# EAGLE design iqdemod (EAGLE 6.3)
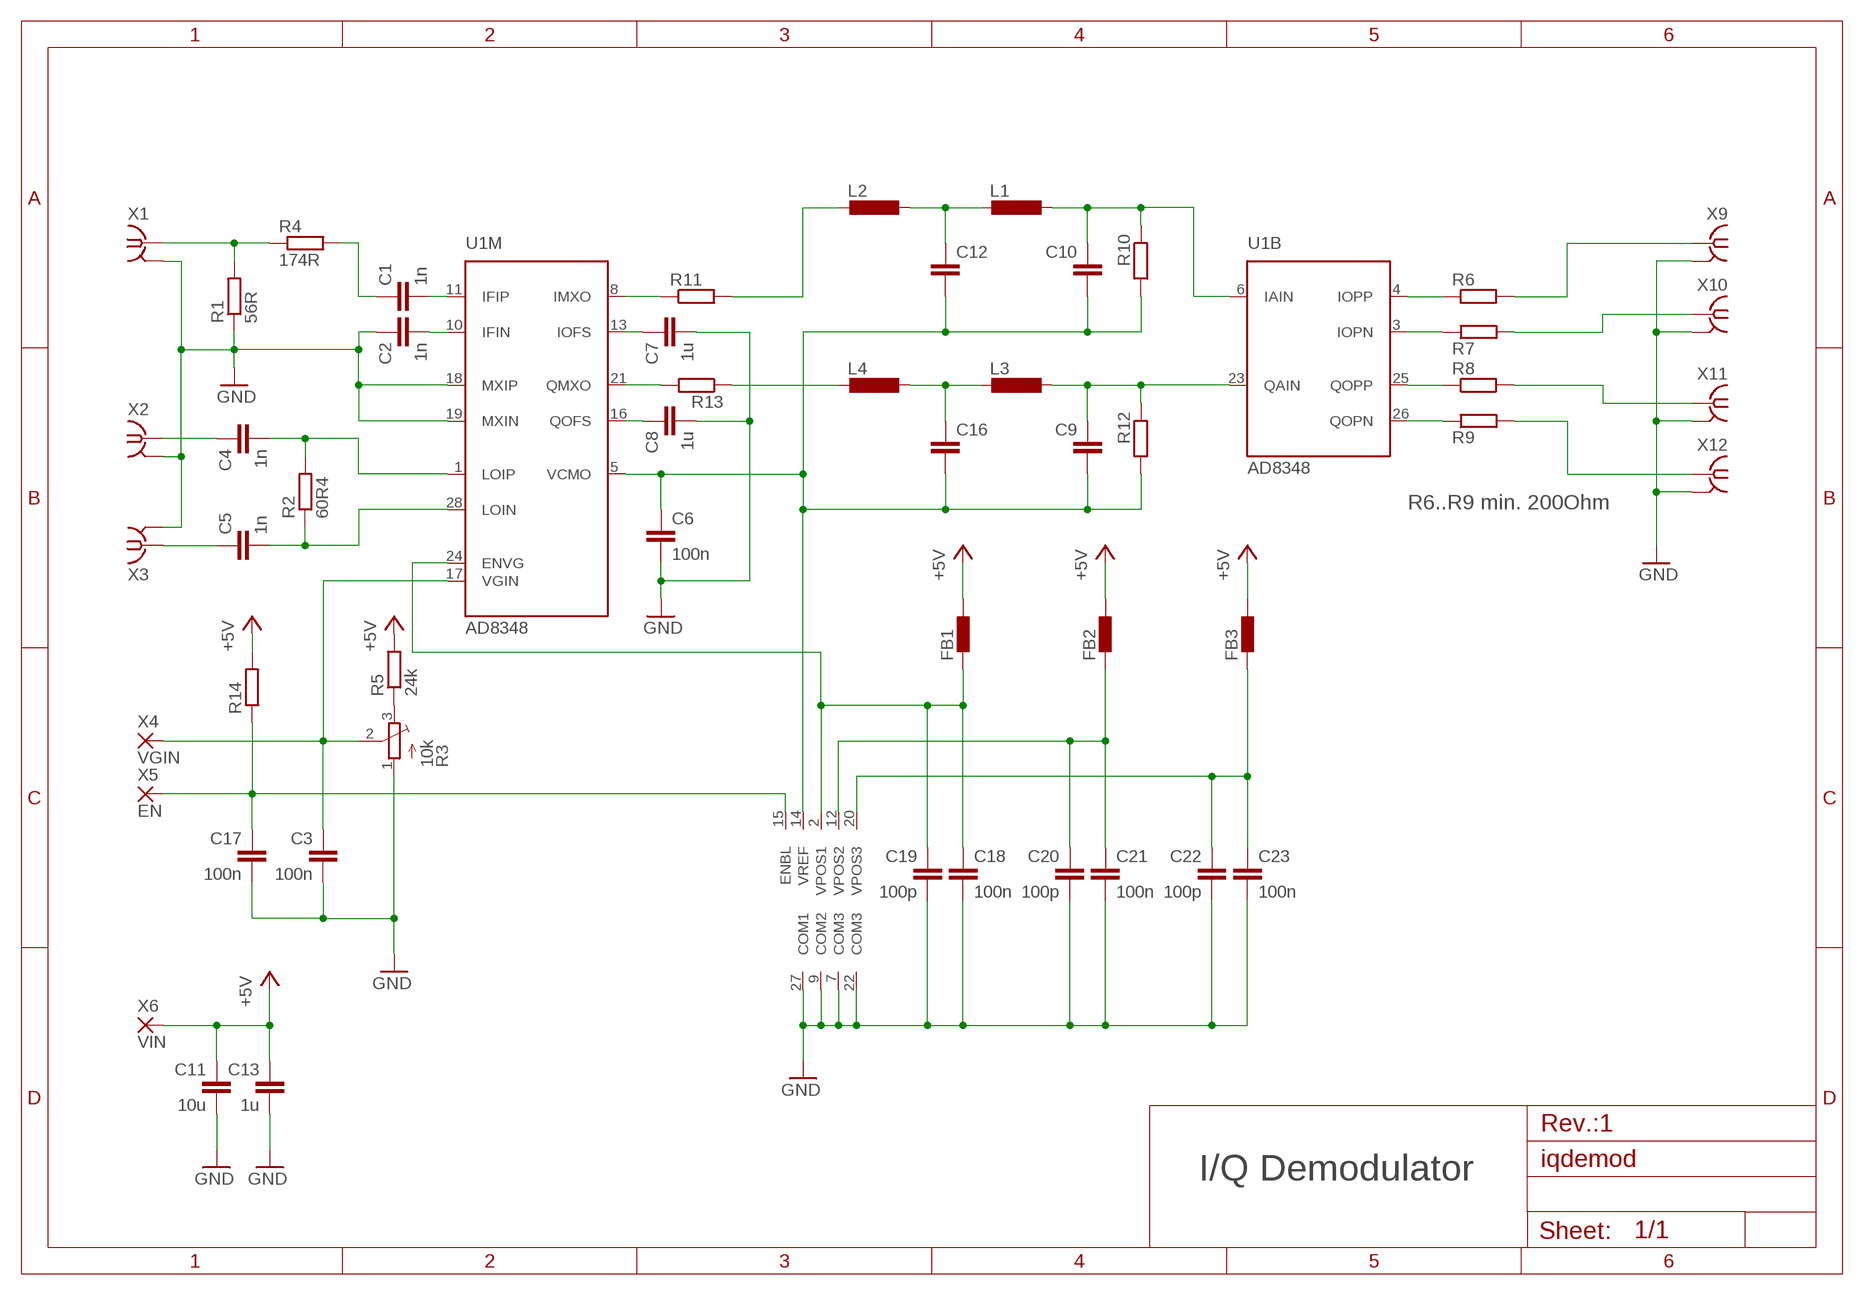
[diagram p0: schematic, sheet 1]

## Parts
C1  1n  C-EUC0603  [C0603]
C2  1n  C-EUC0603  [C0603]
C3  100n  C-EUC0603  [C0603]
C4  1n  C-EUC0603  [C0603]
C5  1n  C-EUC0603  [C0603]
C6  100n  C-EUC0603  [C0603]
C7  1u  C-EUC0603  [C0603]
C8  1u  C-EUC0603  [C0603]
C9  C-EUC0603  [C0603]
C10  C-EUC0603  [C0603]
C11  10u  C-EUC0603  [C0603]
C12  C-EUC0603  [C0603]
C13  1u  C-EUC0603  [C0603]
C16  C-EUC0603  [C0603]
C17  100n  C-EUC0603  [C0603]
C18  100n  C-EUC0603  [C0603]
C19  100p  C-EUC0603  [C0603]
C20  100p  C-EUC0603  [C0603]
C21  100n  C-EUC0603  [C0603]
C22  100p  C-EUC0603  [C0603]
C23  100n  C-EUC0603  [C0603]
FB1  BML15H  [R0603]
FB2  BML15H  [R0603]
FB3  BML15H  [R0603]
L1  L-EUL2012C  [L2012C]
L2  L-EUL2012C  [L2012C]
L3  L-EUL2012C  [L2012C]
L4  L-EUL2012C  [L2012C]
R1  56R  R-EU_R0603  [R0603]
R2  60R4  R-EU_R0603  [R0603]
R3  10k  TRIM_EU-3223J  [3223J]
R4  174R  R-EU_R0603  [R0603]
R5  24k  R-EU_R0603  [R0603]
R6  R-EU_R0603  [R0603]
R7  R-EU_R0603  [R0603]
R8  R-EU_R0603  [R0603]
R9  R-EU_R0603  [R0603]
R10  R-EU_R0603  [R0603]
R11  R-EU_R0603  [R0603]
R12  R-EU_R0603  [R0603]
R13  R-EU_R0603  [R0603]
R14  R-EU_R0603  [R0603]
U1  AD8348  [TSSOP28]
X1  SMA-142-0701-881/886  [J502-ND-142-0701-881/886]
X2  SMA-142-0701-881/886  [J502-ND-142-0701-881/886]
X3  SMA-142-0701-881/886  [J502-ND-142-0701-881/886]
X4  VGIN  SMD2  [SMD1,27-2,54]
X5  EN  SMD2  [SMD1,27-2,54]
X6  VIN  SMD2  [SMD1,27-2,54]
X9  SMA-142-0701-881/886  [J502-ND-142-0701-881/886]
X10  SMA-142-0701-881/886  [J502-ND-142-0701-881/886]
X11  SMA-142-0701-881/886  [J502-ND-142-0701-881/886]
X12  SMA-142-0701-881/886  [J502-ND-142-0701-881/886]

## Nets
+5V: C11.1 C13.1 FB1.2 FB2.2 FB3.2 R5.2 R14.2 X6.1(P)
GND: C2.1 C3.2 C6.2 C7.2 C8.2 C11.2 C13.2 C17.2 C18.2 C19.2 C20.2 C21.2 C22.2 C23.2 R1.1 R3.1(A) U1.7(P:COM3) U1.9(P:COM2) U1.18(M:MXIP) U1.19(M:MXIN) U1.22(P:COM3) U1.27(P:COM1) X1.G@1 X1.G@2 X1.G@3 X1.G@4 X2.G@1 X2.G@2 X2.G@3 X2.G@4 X3.G@1 X3.G@2 X3.G@3 X3.G@4 X9.G@1 X9.G@2 X9.G@3 X9.G@4 X10.G@1 X10.G@2 X10.G@3 X10.G@4 X11.G@1 X11.G@2 X11.G@3 X11.G@4 X12.G@1 X12.G@2 X12.G@3 X12.G@4
N$1: C1.2 U1.11(M:IFIP)
N$2: C2.2 U1.10(M:IFIN)
N$3: R1.2 R4.1 X1.1
N$4: C4.2 R2.2 U1.1(M:LOIP)
N$5: C5.2 R2.1 U1.28(M:LOIN)
N$6: C4.1 X2.1
N$7: C3.1 R3.2(S) U1.17(M:VGIN) X4.1(P)
N$8: C5.1 X3.1
N$9: C1.1 R4.2
N$10: R3.3(E) R5.1
N$11: L2.2 R11.2
N$12: L4.2 R13.1
N$13: R6.1 U1.4(B:IOPP)
N$14: C8.1 U1.16(M:QOFS)
N$15: C7.1 U1.13(M:IOFS)
N$16: C12.1 L1.2 L2.1
N$17: C10.1 L1.1 R10.1 U1.6(B:IAIN)
N$18: R7.1 U1.3(B:IOPN)
N$19: R8.1 U1.25(B:QOPP)
N$20: R9.1 U1.26(B:QOPN)
N$21: R6.2 X9.1
N$22: R7.2 X10.1
N$23: R8.2 X11.1
N$24: R9.2 X12.1
N$25: R11.1 U1.8(M:IMXO)
N$26: C17.1 R14.1 U1.15(P:ENBL) X5.1(P)
N$27: C16.1 L3.2 L4.1
N$28: C9.1 L3.1 R12.1 U1.23(B:QAIN)
N$29: R13.2 U1.21(M:QMXO)
N$30: C18.1 C19.1 FB1.1 U1.2(P:VPOS1) U1.24(M:ENVG)
N$31: C20.1 C21.1 FB2.1 U1.12(P:VPOS2)
N$32: C22.1 C23.1 FB3.1 U1.20(P:VPOS3)
VREF: C6.1 C9.2 C10.2 C12.2 C16.2 R10.2 R12.2 U1.5(M:VCMO) U1.14(P:VREF)

## Notes on the sheet
- R6..R9 min. 200Ohm
- Rev.:1
- I/Q Demodulator

## Library data of the parts
C1-C13 C16-C23 = rcl:C-EU: CAPACITOR, European symbol
FB1-FB3 = ferrite-bead:BML15H: EMIFIL (R) Chip Ferrite Bead for GHz Noise Source: http://www.murata.com/ Ferrite Bead BLM15H.pdf
L1-L4 = rcl:L-EU: INDUCTOR, European symbol
R1 R2 R4-R14 = rcl:R-EU_: RESISTOR, European symbol
R3 = pot:TRIM_EU-: POTENTIOMETER
U1 = ad8348:AD8348
X1-X3 X9-X12 = con-coax:SMA-: SMA 50 Ohm End Launch Jack Receptacle - Round Contact Johnson Components Source: www.johnsoncomponents.com .. J502-ND.pdf; MF: JOHNSON COMPONENTS; MPN: 142-0701-881; OC_FARNELL: 1608603; OC_NEWARK: 08B906
X4-X6 = wirepad:SMD2: SMD PAD

## Board
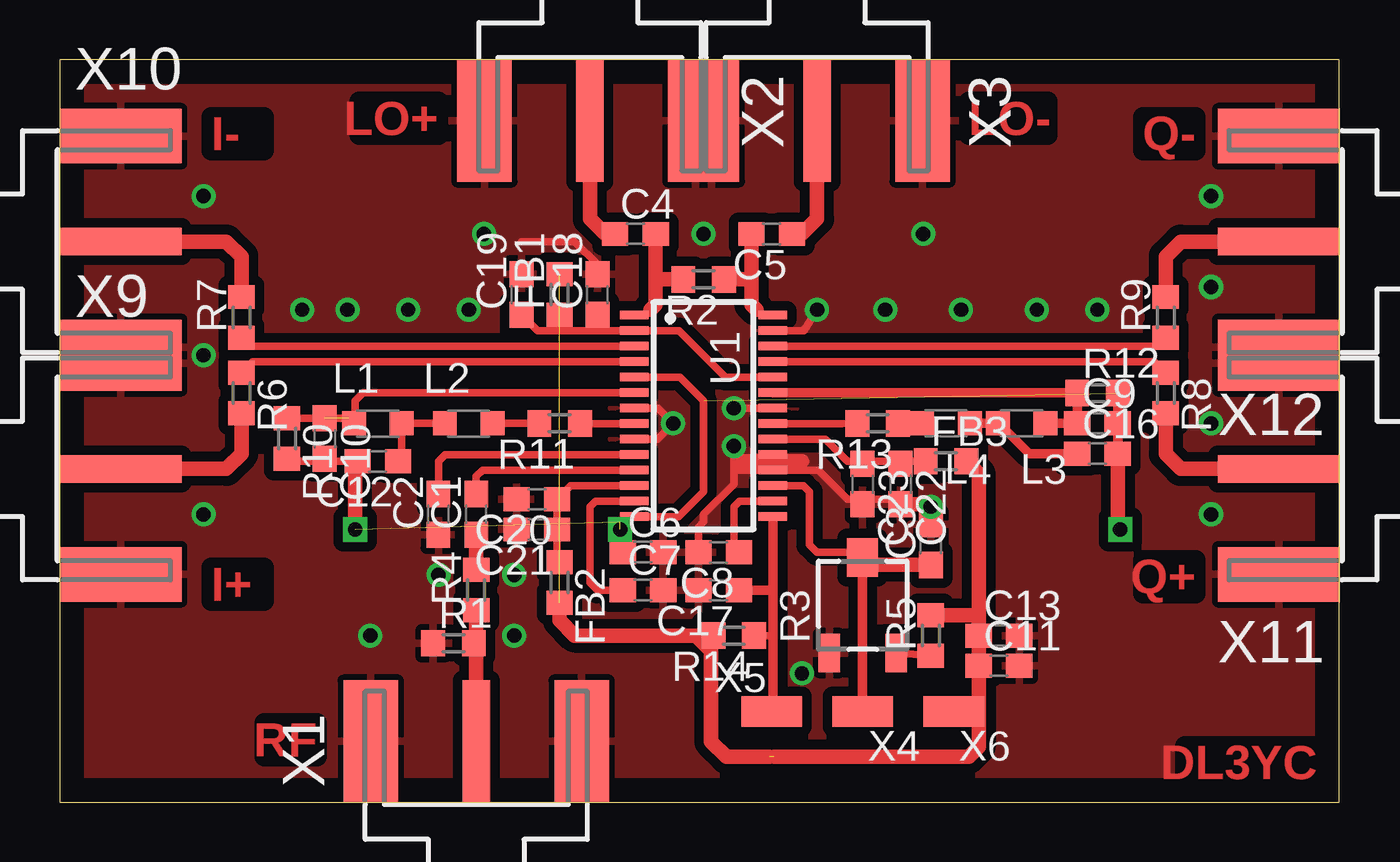
[diagram p1: board, top side]
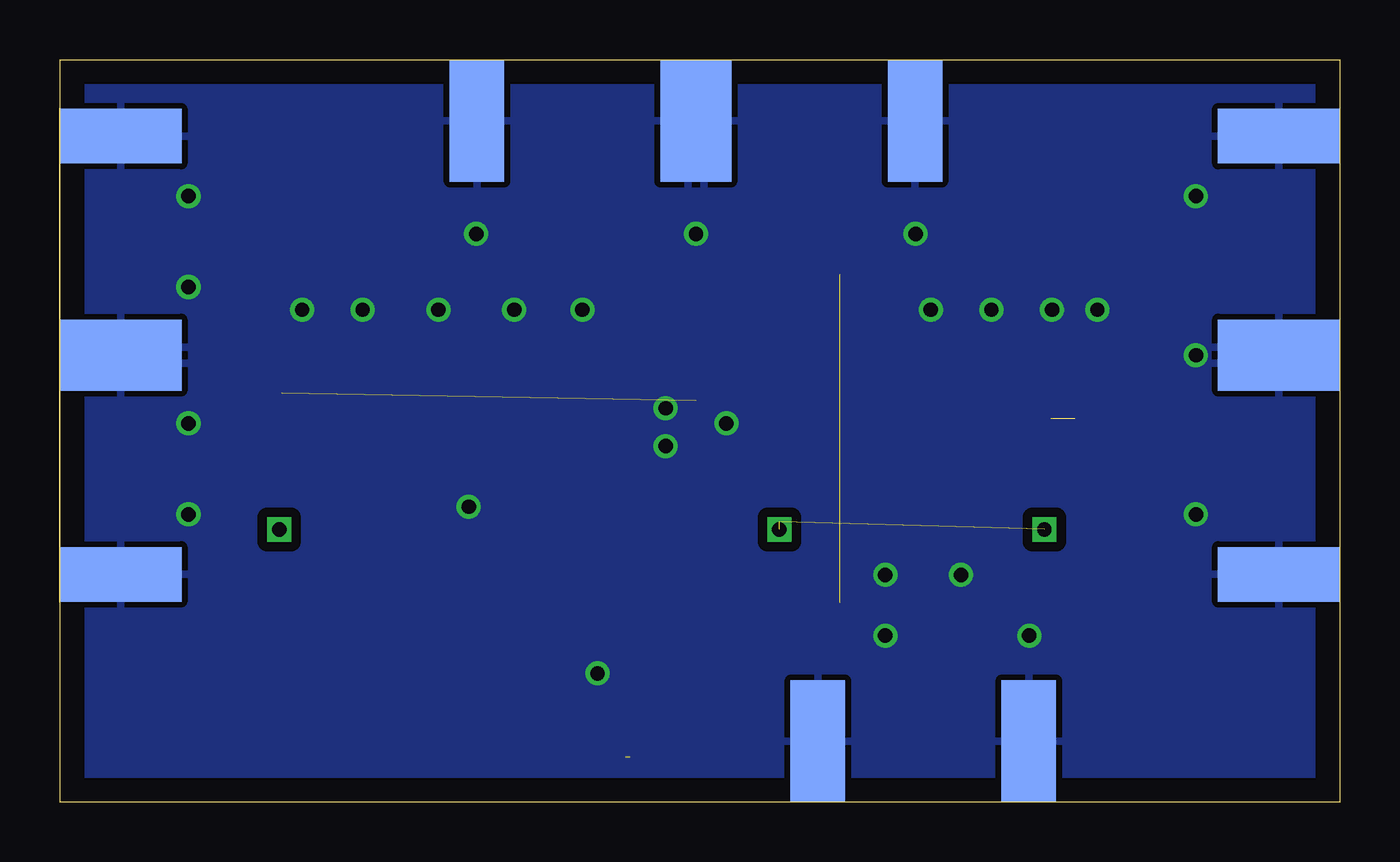
[diagram p2: board, bottom side, seen from below]

Size 53.66 x 31.11 mm. Coordinates in mm from the lower left corner, seen from the top.
Outline: 0,0 53.64,0 53.64,31.1 0,31.1 0,0
Copper layers (1*16): Top 0.035mm / dielectric 1.5mm / Bottom 0.035mm
Design rules "default": minimum track width 10mil, minimum drill 24mil, track to track 8mil, track to pad 8mil, pad to pad 8mil, via to via 8mil, smd to smd 8mil, copper to edge 40mil, drill to drill 8mil, minimum pad ring 10mil, minimum via ring 8mil, stop-mask expansion 4mil, vias tented up to drill 0mil, thermal gap 10mil

### Footprints (pad centres in the part's own frame; a part is rotated, then mirrored left to right if it is on the bottom)
C0603 = smd 1.1 x 1: 1 -0.85,0; 2 0.85,0
R0603 = smd 1 x 1.1: 1 -0.85,0; 2 0.85,0
L2012C = smd 1 x 1: 1 -1,0; 2 1,0
3223J = smd 1.6 x 0.9: 1 -2,1.4; 3 -2,-1.4 | smd 1.6 x 1.3: 2 2,0
TSSOP28 = smd 0.35 x 1.2: 1 -4.225,-2.9; 2 -3.575,-2.9; 3 -2.925,-2.9; 4 -2.275,-2.9; 5 -1.625,-2.9; 6 -0.975,-2.9; 7 -0.325,-2.9; 8 0.325,-2.9; 9 0.975,-2.9; 10 1.625,-2.9; 11 2.275,-2.9; 12 2.925,-2.9; 13 3.575,-2.9; 14 4.225,-2.9; 15 4.225,2.9; 16 3.575,2.9; 17 2.925,2.9; 18 2.275,2.9; 19 1.625,2.9; 20 0.975,2.9; 21 0.325,2.9; 22 -0.325,2.9; 23 -0.975,2.9; 24 -1.625,2.9; 25 -2.275,2.9; 26 -2.925,2.9; 27 -3.575,2.9; 28 -4.225,2.9
J502-ND-142-0701-881/886 = smd 5.08 x 1.143: 1 2.565,0 | smd 5.08 x 2.286: G@1 2.565,4.42; G@2 2.565,-4.42 | smd 5.08 x 2.286 bottom: G@3 2.565,4.42; G@4 2.565,-4.42
SMD1,27-2,54 = smd 1.27 x 2.54: 1 0,0

### Placement (x,y rotation side)
C1  17.46,12.06 90 top
C2  15.88,12.06 90 top
C3  36.51,10.79 90 top
C4  24.13,23.81 0 top
C5  29.84,23.81 180 top
C6  24.45,10.48 0 top
C7  24.45,8.89 0 top
C8  27.62,10.48 180 top
C9  43.5,15.88 0 top
C10  11.11,15.24 270 top
C11  39.37,5.71 0 top
C12  13.34,14.29 180 top
C13  39.37,6.99 0 top
C16  43.5,14.61 0 top
C17  27.62,8.89 180 top
C18  22.54,21.27 90 top
C19  19.37,21.27 90 top
C20  20,12.7 180 top
C21  20,11.43 180 top
C22  35.24,13.34 270 top
C23  33.66,13.34 270 top
FB1  20.95,21.27 90 top
FB2  20.95,9.21 270 top
FB3  37.15,14.29 0 top
L1  13.34,15.88 0 top
L2  17.14,15.88 0 top
L3  40.32,15.88 180 top
L4  37.15,15.88 180 top
R1  16.51,6.67 0 top
R2  26.99,21.91 180 top
R3  33.66,8.26 90 top
R4  17.46,8.89 90 top
R5  36.51,6.99 90 top
R6  7.62,17.14 270 top
R7  7.62,20.32 90 top
R8  46.35,17.14 270 top
R9  46.35,20.32 90 top
R10  9.53,15.24 270 top
R11  20.95,15.88 180 top
R12  43.5,17.14 0 top
R13  34.29,15.88 180 top
R14  28.26,6.99 180 top
U1  26.99,16.19 270 top
X1  17.46,0 90 top
X2  22.23,31.11 270 top
X3  31.75,31.11 270 top
X4  33.66,3.81 90 top
X5  29.84,3.81 270 top
X6  37.47,3.81 90 top
X9  0,13.97 0 top
X10  0,23.5 0 top
X11  53.66,13.97 180 top
X12  53.66,23.5 180 top

### Tracks (layer width: path | path; a pad name or v marks a point on that pad's centre or on a via)
+5V  (2 unrouted)
  Top 0.305: R14.2 27.3,6.99 26.99,6.67
  Top 0.61: 38.52,3.81 C11.1 C13.1 38.52,7.62 | 38.52,3.81 38.52,2.33 38.1,1.91 29.95,1.91 | X6.1 38.52,3.81 | FB2.2 20.95,7.62 21.59,6.99 26.67,6.99 26.99,6.67 27.3,6.35 27.3,2.54 27.94,1.91 29.74,1.91 | 38.52,7.62 38.52,13.77 FB3.2 | R5.2 38.3,7.83 38.52,7.62
GND  (via drill 0.6)
  Top 0.305: U1.18 31.8,13.92 33.02,12.7 33.66,12.7 | U1.19 U1.18 | 33.66,12.7 35.03,12.7 | C23.2 33.66,12.7 | U1.7 25.07,16.52 v25.72,15.88 25.06,15.22 U1.9 | U1.27 31.2,19.77 v31.75,20.64 | C18.2 22.54,22.54 21.59,23.5 19.37,23.5 | U1.22 v28.27,16.52 v28.26,16.51 | U1.18 28.31,13.92 28.26,13.97 v28.26,14.92 28.26,13.34 26.99,12.06 26.99,11.75 26.77,11.53 C8.2
  Top 0.406: 35.03,12.7 C22.2
  Top 0.61: C22.2 36.09,12.48 36.51,12.06 C3.2 | 31.11,14.29 28.57,14.29
  other vias: 36.51,12.38 34.61,20.64 37.78,20.64 40.96,20.64 43.5,20.64 26.99,23.81 17.14,20.64 14.61,20.64 12.06,20.64 10.16,20.64 19.05,9.53 19.05,6.99 15.88,9.53 6.03,12.06 6.03,18.73 31.11,5.4 48.26,21.59 48.26,15.88 48.26,25.4 48.26,12.06 6.03,25.4 13.02,6.99 17.78,23.81 36.2,23.81
  pour Top (isolate 0.406): 0,31.11 53.66,31.11 53.66,0 0,0 0,30.8
  pour Bottom (isolate 0.406): 0,31.11 53.66,31.11 53.66,0 0,0
N$1
  Top 0.305: U1.11 17.73,13.92 17.46,13.65 C1.2
N$2
  Top 0.305: U1.10 16.16,14.57 15.88,14.29 C2.2
N$3
  Top 0.61: R4.1 17.46,6.67 | 17.46,6.67 X1.1 | R1.2 17.46,6.67
N$4
  Top 0.33: U1.1 24.55,20.42 24.77,20.64
  Top 0.61: C4.2 24.98,21.91 | 24.98,21.91 24.98,20.85 24.77,20.64 | R2.2 24.98,21.91
N$5
  Top 0.33: U1.28 29.43,20.42 29.21,20.64
  Top 0.61: C5.2 29,21.91 | 29,21.91 29,20.85 29.21,20.64 | R2.1 29,21.91
N$6
  Top 0.61: C4.1 22.86,23.81 22.23,24.45 X2.1
N$7
  Top 0.305: U1.17 31.18,13.27 31.43,13.02 31.43,10.79 31.75,10.48 33.43,10.48 R3.2
  Top 0.406: R3.2 X4.1
  Top 0.61: C3.1 33.97,9.95 R3.2
N$8
  Top 0.61: C5.1 31.11,23.81 31.75,24.45 X3.1
N$9
  Top 0.61: C1.1 R4.2
N$10
  Top 0.305: R3.3 R5.1
N$11
  Top 0.305: R11.2 L2.2
N$12
  Top 0.406: R13.1 L4.2
N$13
  Top 0.305: U1.4 8.09,18.47 R6.1
N$14
  Top 0.305: U1.16 28.49,12.62 28.26,12.38 28.26,10.69 C8.1
N$15
  Top 0.305: U1.13 22.46,12.62 22.23,12.38 22.23,9.21 22.54,8.89 C7.1
N$16
  Top 0.305: L2.1 L1.2 14.34,14.44 C12.1
N$17  (1 unrouted)
  Top 0.305: U1.6 12.72,17.17 12.38,16.83 12.38,15.92 L1.1 12.12,16.09 R10.1
N$18
  Top 0.305: U1.3 7.97,19.12 R7.1
N$19
  Top 0.305: U1.25 45.88,18.47 R8.1
N$20
  Top 0.305: U1.26 46,19.12 R9.1
N$21
  Top 0.61: R6.2 7.62,14.61 6.99,13.97 X9.1
N$22
  Top 0.61: R7.2 7.62,22.86 6.99,23.5 X10.1 1.91,23.5
N$23
  Top 0.61: R8.2 46.35,14.61 46.99,13.97 X11.1
N$24
  Top 0.61: R9.2 46.35,22.86 46.99,23.5 X12.1
N$25
  Top 0.305: U1.8 21.81,15.87 R11.1
N$26
  Top 0.305: R14.1 29.89,6.99
  Top 0.406: U1.15 29.89,8.89 | 29.89,8.89 29.89,6.99 29.89,3.85 X5.1 | C17.1 29.89,8.89
N$27
  Top 0.406: L4.1 L3.2 39.37,15.88 40.64,14.61 C16.1
N$28
  Top 0.406: U1.23 42.62,17.17 R12.1 C9.1 L3.1
N$29
  Top 0.305: U1.21 32.8,15.87 R13.2
N$30
  Top 0.305: 22.23,19.77 U1.2 25.95,19.77 27.9,17.82 U1.24 | 22.23,19.77 20.64,19.77 | 20.64,19.77 20.02,19.77 C19.1 | C18.1 22.54,20.09 22.23,19.77 | FB1.1 20.95,20.09 20.64,19.77
N$31
  Top 0.305: U1.12 21.42,13.27 C20.1 C21.1 20.85,10.16 FB2.1
N$32
  Top 0.305: U1.20 32.09,15.22 33.02,14.29 33.66,14.29 | 33.66,14.29 35.24,14.29 | 35.24,14.29 FB3.1 | C22.1 35.24,14.29 | C23.1 33.66,14.29
VREF  (via drill 0.6)  (3 unrouted)
  Top 0.305: U1.5 26,17.82 26.99,16.83 26.99,13.02 25.94,11.97 U1.14 23.71,11.97 23.5,11.75 23.5,10.58 C6.1 | C12.2 12.38,14.29 11.11,14.29 | 11.11,14.29 9.63,14.29 R10.2 | C10.2 11.11,14.29
  Top 0.406: C16.2 C9.2 R12.2
  Top 0.61: v12.38,11.43 12.38,14.29 | C16.2 44.35,11.53 v44.45,11.43
  other vias: 23.5,11.43

### Text on the board
Top: LO+ | LO- | I- | Q- | I+ | Q+ | RF | DL3YC